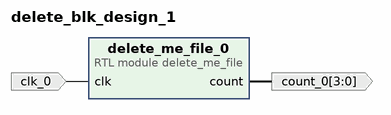
[diagram p0: block diagram of the top level]
# Vivado block design delete_blk_design_1, xc7z010clg225-1, Vivado 2018.2
create_bd_design delete_blk_design_1

create_bd_port -dir I -type clk clk_0
create_bd_port -dir O -from 3 -to 0 count_0

create_bd_cell -type module -reference delete_me_file delete_me_file_0

# ---- connections ----

connect_bd_net -net clk_0_1 [get_bd_ports clk_0] [get_bd_pins delete_me_file_0/clk]
connect_bd_net [get_bd_pins delete_me_file_0/count] [get_bd_ports count_0]

validate_bd_design
save_bd_design
